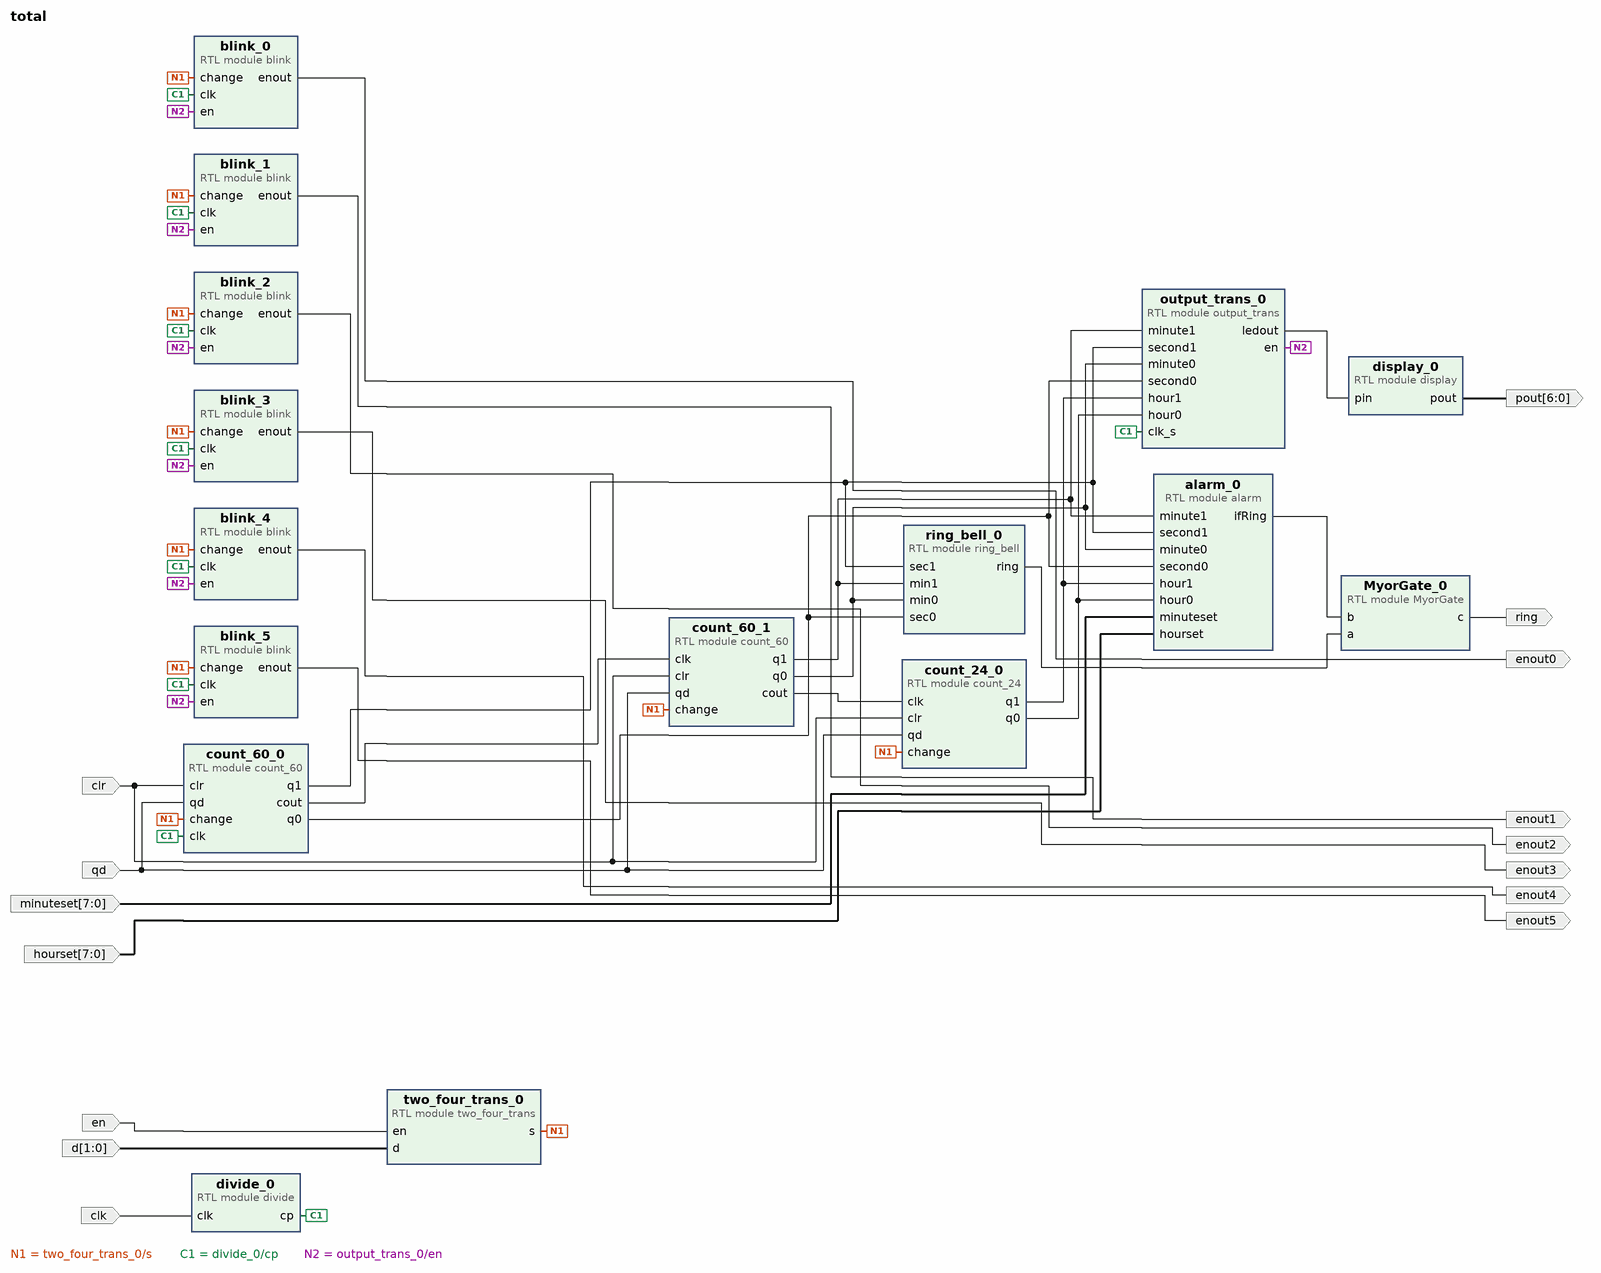
[diagram p0: block diagram of the top level]
# Vivado block design total, xa7a100tfgg484-1I, Vivado 2018.3
create_bd_design total

create_bd_port -dir I clk
create_bd_port -dir I en
create_bd_port -dir I -from 1 -to 0 d
create_bd_port -dir I clr
create_bd_port -dir I qd
create_bd_port -dir O enout0
create_bd_port -dir O enout1
create_bd_port -dir O enout2
create_bd_port -dir O enout3
create_bd_port -dir O enout4
create_bd_port -dir O enout5
create_bd_port -dir O -from 6 -to 0 pout
create_bd_port -dir I -from 7 -to 0 minuteset
create_bd_port -dir I -from 7 -to 0 hourset
create_bd_port -dir O ring

create_bd_cell -type module -reference display display_0
create_bd_cell -type module -reference blink blink_0
create_bd_cell -type module -reference output_trans output_trans_0
create_bd_cell -type module -reference two_four_trans two_four_trans_0
create_bd_cell -type module -reference count_60 count_60_1
create_bd_cell -type module -reference count_60 count_60_0
create_bd_cell -type module -reference blink blink_5
create_bd_cell -type module -reference ring_bell ring_bell_0
create_bd_cell -type module -reference blink blink_4
create_bd_cell -type module -reference count_24 count_24_0
create_bd_cell -type module -reference blink blink_3
create_bd_cell -type module -reference blink blink_2
create_bd_cell -type module -reference blink blink_1
create_bd_cell -type module -reference alarm alarm_0
create_bd_cell -type module -reference MyorGate MyorGate_0
create_bd_cell -type module -reference divide divide_0

# ---- connections ----

connect_bd_net [get_bd_pins count_60_0/cout] [get_bd_pins count_60_1/clk]
connect_bd_net [get_bd_pins two_four_trans_0/s] \
  [get_bd_pins count_60_0/change] [get_bd_pins count_60_1/change] [get_bd_pins count_24_0/change] \
  [get_bd_pins blink_0/change] [get_bd_pins blink_1/change] [get_bd_pins blink_2/change] [get_bd_pins blink_3/change] \
  [get_bd_pins blink_4/change] [get_bd_pins blink_5/change]
connect_bd_net [get_bd_pins divide_0/cp] \
  [get_bd_pins count_60_0/clk] [get_bd_pins blink_0/clk] [get_bd_pins blink_1/clk] [get_bd_pins blink_2/clk] \
  [get_bd_pins blink_3/clk] [get_bd_pins blink_4/clk] [get_bd_pins blink_5/clk] [get_bd_pins output_trans_0/clk_s]
connect_bd_net [get_bd_pins output_trans_0/en] \
  [get_bd_pins blink_0/en] [get_bd_pins blink_1/en] [get_bd_pins blink_2/en] [get_bd_pins blink_3/en] \
  [get_bd_pins blink_4/en] [get_bd_pins blink_5/en]
connect_bd_net [get_bd_pins count_24_0/q1] [get_bd_pins output_trans_0/hour1] [get_bd_pins alarm_0/hour1]
connect_bd_net [get_bd_pins count_60_1/q1] [get_bd_pins ring_bell_0/min1] [get_bd_pins output_trans_0/minute1] [get_bd_pins alarm_0/minute1]
connect_bd_net [get_bd_pins count_60_1/cout] [get_bd_pins count_24_0/clk]
connect_bd_net [get_bd_pins count_24_0/q0] [get_bd_pins output_trans_0/hour0] [get_bd_pins alarm_0/hour0]
connect_bd_net [get_bd_pins count_60_1/q0] [get_bd_pins ring_bell_0/min0] [get_bd_pins output_trans_0/minute0] [get_bd_pins alarm_0/minute0]
connect_bd_net [get_bd_pins output_trans_0/ledout] [get_bd_pins display_0/pin]
connect_bd_net [get_bd_pins count_60_0/q1] [get_bd_pins ring_bell_0/sec1] [get_bd_pins output_trans_0/second1] [get_bd_pins alarm_0/second1]
connect_bd_net [get_bd_pins count_60_0/q0] [get_bd_pins ring_bell_0/sec0] [get_bd_pins output_trans_0/second0] [get_bd_pins alarm_0/second0]
connect_bd_net [get_bd_ports clk] [get_bd_pins divide_0/clk]
connect_bd_net [get_bd_ports en] [get_bd_pins two_four_trans_0/en]
connect_bd_net [get_bd_ports d] [get_bd_pins two_four_trans_0/d]
connect_bd_net [get_bd_ports clr] [get_bd_pins count_60_0/clr] [get_bd_pins count_60_1/clr] [get_bd_pins count_24_0/clr]
connect_bd_net [get_bd_ports qd] [get_bd_pins count_60_0/qd] [get_bd_pins count_24_0/qd] [get_bd_pins count_60_1/qd]
connect_bd_net [get_bd_pins blink_0/enout] [get_bd_ports enout0]
connect_bd_net [get_bd_pins blink_1/enout] [get_bd_ports enout1]
connect_bd_net [get_bd_pins blink_2/enout] [get_bd_ports enout2]
connect_bd_net [get_bd_pins blink_3/enout] [get_bd_ports enout3]
connect_bd_net [get_bd_pins blink_4/enout] [get_bd_ports enout4]
connect_bd_net [get_bd_pins blink_5/enout] [get_bd_ports enout5]
connect_bd_net [get_bd_pins display_0/pout] [get_bd_ports pout]
connect_bd_net [get_bd_pins ring_bell_0/ring] [get_bd_pins MyorGate_0/a]
connect_bd_net [get_bd_pins alarm_0/ifRing] [get_bd_pins MyorGate_0/b]
connect_bd_net [get_bd_ports minuteset] [get_bd_pins alarm_0/minuteset]
connect_bd_net [get_bd_ports hourset] [get_bd_pins alarm_0/hourset]
connect_bd_net [get_bd_pins MyorGate_0/c] [get_bd_ports ring]

validate_bd_design
save_bd_design
